# Altium schematic sheet main.SchDoc
size A; SheetNumber: 2; SheetTotal: 2
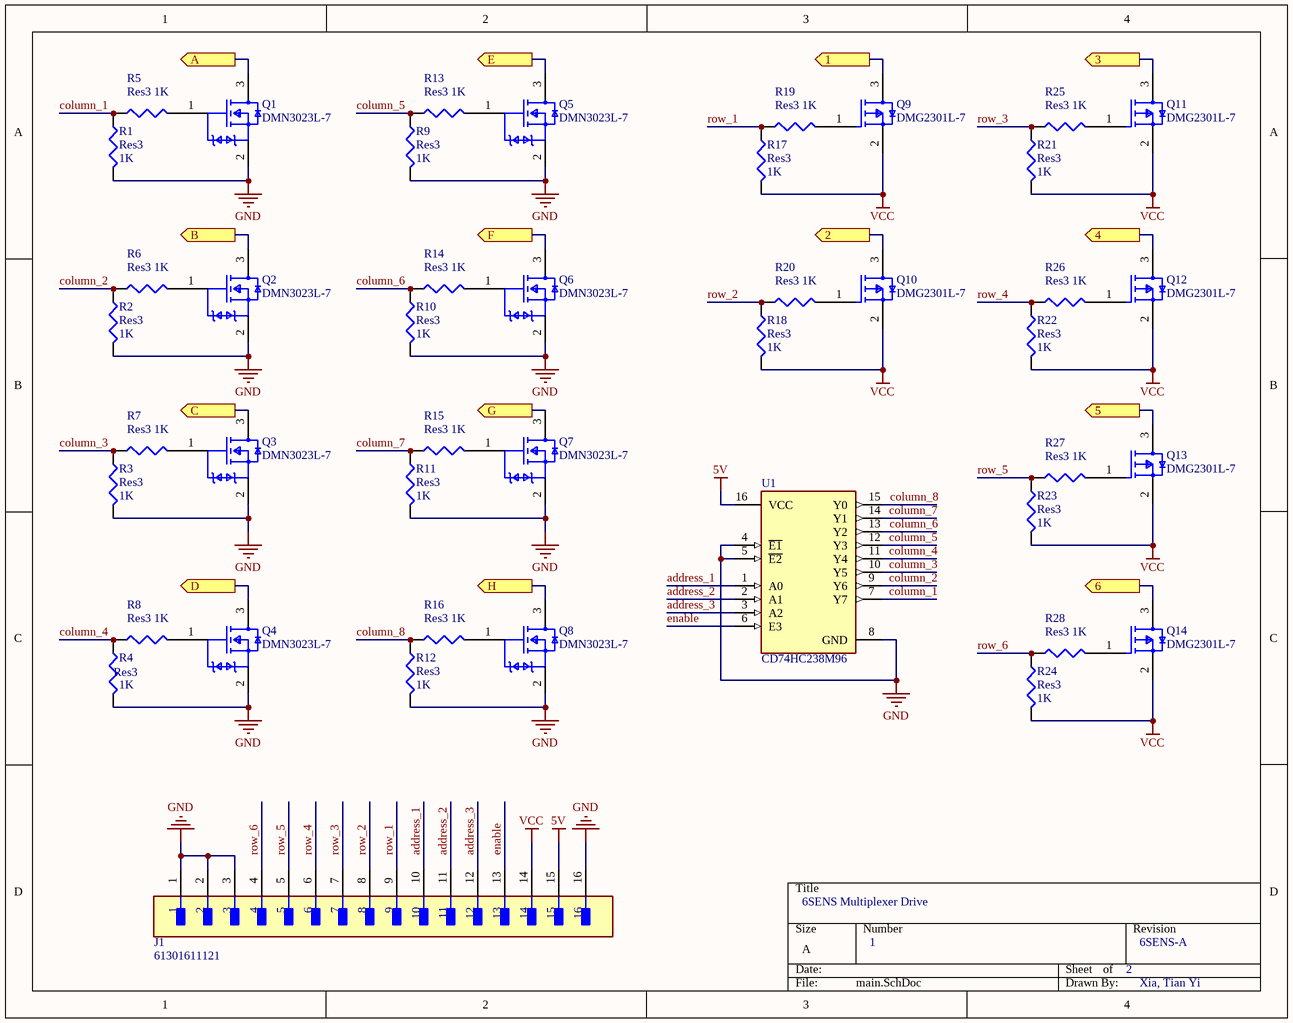
[diagram p0: main.SchDoc]

## Parts
J1  61301611121  [FP-61301611121-MFG]
Q1  DMN3023L-7  [FP-SOT23-MFG]
Q2  DMN3023L-7  [FP-SOT23-MFG]
Q3  DMN3023L-7  [FP-SOT23-MFG]
Q4  DMN3023L-7  [FP-SOT23-MFG]
Q5  DMN3023L-7  [FP-SOT23-MFG]
Q6  DMN3023L-7  [FP-SOT23-MFG]
Q7  DMN3023L-7  [FP-SOT23-MFG]
Q8  DMN3023L-7  [FP-SOT23-MFG]
Q9  DMG2301L-7  [FP-SOT23-MFG]
Q10  DMG2301L-7  [FP-SOT23-MFG]
Q11  DMG2301L-7  [FP-SOT23-MFG]
Q12  DMG2301L-7  [FP-SOT23-MFG]
Q13  DMG2301L-7  [FP-SOT23-MFG]
Q14  DMG2301L-7  [FP-SOT23-MFG]
R1  Res3  value 1K  [J1-0603]
R2  Res3  value 1K  [J1-0603]
R3  Res3  value 1K  [J1-0603]
R4  Res3  value 1K  [J1-0603]
R5  Res3  value 1K  [J1-0603]
R6  Res3  value 1K  [J1-0603]
R7  Res3  value 1K  [J1-0603]
R8  Res3  value 1K  [J1-0603]
R9  Res3  value 1K  [J1-0603]
R10  Res3  value 1K  [J1-0603]
R11  Res3  value 1K  [J1-0603]
R12  Res3  value 1K  [J1-0603]
R13  Res3  value 1K  [J1-0603]
R14  Res3  value 1K  [J1-0603]
R15  Res3  value 1K  [J1-0603]
R16  Res3  value 1K  [J1-0603]
R17  Res3  value 1K  [J1-0603]
R18  Res3  value 1K  [J1-0603]
R19  Res3  value 1K  [J1-0603]
R20  Res3  value 1K  [J1-0603]
R21  Res3  value 1K  [J1-0603]
R22  Res3  value 1K  [J1-0603]
R23  Res3  value 1K  [J1-0603]
R24  Res3  value 1K  [J1-0603]
R25  Res3  value 1K  [J1-0603]
R26  Res3  value 1K  [J1-0603]
R27  Res3  value 1K  [J1-0603]
R28  Res3  value 1K  [J1-0603]
U1  CD74HC238M96  [FP-D0016A-MFG]

## Ports
1 (out), 2 (out), 3 (out), 4 (out), 5 (out), 6 (out), A (out), B (out), C (out), D (out), E (out), F (out), G (out), H (out)

## Nets
5V: J1.15 U1.16(VCC)
GND: J1.1 J1.2 J1.3 J1.16 Q1.2(S) Q2.2(S) Q3.2(S) Q4.2(S) Q5.2(S) Q6.2(S) Q7.2(S) Q8.2(S) R1.2 R2.2 R3.2 R4.2 R9.2 R10.2 R11.2 R12.2 U1.4(~{E1}) U1.5(~{E2}) U1.8(GND)
VCC: J1.14 Q9.2(S) Q10.2(S) Q11.2(S) Q12.2(S) Q13.2(S) Q14.2(S) R17.2 R18.2 R21.2 R22.2 R23.2 R24.2
1: Q9.3(D) ; port 1
2: Q10.3(D) ; port 2
3: Q11.3(D) ; port 3
4: Q12.3(D) ; port 4
5: Q13.3(D) ; port 5
6: Q14.3(D) ; port 6
A: Q1.3(D) ; port A
address_1: J1.10 U1.1(A0)
address_2: J1.11 U1.2(A1)
address_3: J1.12 U1.3(A2)
B: Q2.3(D) ; port B
C: Q3.3(D) ; port C
column_1: R1.1 R5.1 U1.7(Y7)
column_2: R2.1 R6.1 U1.9(Y6)
column_3: R3.1 R7.1 U1.10(Y5)
column_4: R4.1 R8.1 U1.11(Y4)
column_5: R9.1 R13.1 U1.12(Y3)
column_6: R10.1 R14.1 U1.13(Y2)
column_7: R11.1 R15.1 U1.14(Y1)
column_8: R12.1 R16.1 U1.15(Y0)
D: Q4.3(D) ; port D
E: Q5.3(D) ; port E
enable: J1.13 U1.6(E3)
F: Q6.3(D) ; port F
G: Q7.3(D) ; port G
H: Q8.3(D) ; port H
row_1: J1.9 R17.1 R19.1
row_2: J1.8 R18.1 R20.1
row_3: J1.7 R21.1 R25.1
row_4: J1.6 R22.1 R26.1
row_5: J1.5 R23.1 R27.1
row_6: J1.4 R24.1 R28.1
NetQ1_1: Q1.1(G) R5.2
NetQ2_1: Q2.1(G) R6.2
NetQ3_1: Q3.1(G) R7.2
NetQ4_1: Q4.1(G) R8.2
NetQ5_1: Q5.1(G) R13.2
NetQ6_1: Q6.1(G) R14.2
NetQ7_1: Q7.1(G) R15.2
NetQ8_1: Q8.1(G) R16.2
NetQ9_1: Q9.1(G) R19.2
NetQ10_1: Q10.1(G) R20.2
NetQ11_1: Q11.1(G) R25.2
NetQ12_1: Q12.1(G) R26.2
NetQ13_1: Q13.1(G) R27.2
NetQ14_1: Q14.1(G) R28.2

## Notes on the sheet
- 6SENS Multiplexer Drive
- 1
- 2
- 6SENS-A
- Xia, Tian Yi

## Library data of the parts
J1 = CMP-1502-01095-2: CONN HEADER VERT 16POS 2.54MM; Pitch: 0.1inch; Voltage Rating: 250V; Number of Contacts: 16; Gender: Male; Flammability Rating: UL94 V-0; Fastening Type: Pull; Contact Plating: Gold; Termination: Solder; Contact Type: Male Pin; Number of Rows: 1; Max Operating Temperature: 105°C; Insulation Color: Black; Min Operating Temperature: -40°C; Mount: Through Hole; Contact Mating Length: 0.236inch; Contact Finish - Mating: GOLD; Insulation Material: Nylon; Color: Black; Packaging: Bulk; Number of Positions: 16; RoHS Compliant: Yes; Series: WR-PHD; Connector Type: Header; Contact Material: Copper Alloy; Contact Shape: Square
Q1-Q8 = CMP-12801-000035-1: MOSFET N-CH 30V 6.2A SOT23; Manufacturer: Diodes Inc.; Automotive Grade: Grade 0; Max Junction Temp: +150°C; Number Of Channels: 1; Threshold Vgs Max: 1.8V; Depletion Mode: False; Input Capacitace At Vds: 873pF @ 15V; Turn Off Delay Time: 231ns; Pulse Drain Current: 44A; Standoff Height: 0.013mm; Gate To Source Voltage: 20V; Rthja Max: 97°C/W; Gate Charge At Vgs: 18.4nC @ 10V; Drain To Source Resistance: 25mΩ; Threshold Vgs Min: 0.8V; Turn On Delay Time: 17ns; Power Dissipation: 0.9W; Max Forward Diode Voltage: 1.2V; Category: Trans; Octopart: https://octopart.com/dmn3023l-7-diodes+inc.-65294126; Mouser Description: MOSFET N-Ch Enh Mode FET 30Vdss 20Vgss 51A; Digikey Description: MOSFET N-CH 30V 6.2A SOT23; Package: SOT23; Automotive: Yes; Number Of N Channels: 1; Height: 1.1mm; Device Class L3: MOSFETs; Device Class L1: Discrete Semiconductors; Footprint Url: https://www.diodes.com/assets/Package-Files/SOT23.pdf; Drain To Source Voltage: 30V; Device Class L2: Transistors; ComponentLink2Description: Datasheet; RoHS: TRUE; Continuous Drain Current: 6.2A; Lead Free: Yes; Temperature Range High: +150°C; Temperature: -55°C to +150°C; Manufacturer Part Number: DMN3023L-7; Drain To Source Breakdown Voltage: 30V; ComponentLink2URL: https://www.diodes.com/assets/Datasheets/DMN3023L.pdf; Temperature Range Low: -55°C
Q9-Q14 = CMP-12801-000065-1: MOSFET P-CH 20V 3A SOT23; Manufacturer: Diodes Inc.; Number Of Channels: 1; Turn On Delay Time: 5ns; Drain To Source Resistance: 120mΩ; Max Junction Temp: +150°C; Gate To Source Voltage: 8V; Power Dissipation: 1.5W; Rthja Max: 83°C/W; Max Forward Diode Voltage: -1.2V; Standoff Height: 0.013mm; Threshold Vgs Min: -0.4V; Input Capacitace At Vds: 476pF @ -10V; Depletion Mode: False; Gate Charge At Vgs: 5.5nC @ -4.5V; Pulse Drain Current: -10A; Drain To Source Voltage: -20V; Continuous Drain Current: -3A; Turn Off Delay Time: 30ns; Lead Free: Yes; Package: SOT23; ComponentLink2Description: Datasheet; Device Class L3: MOSFETs; Device Class L1: Discrete Semiconductors; Manufacturer Part Number: DMG2301L-7; Automotive: No; Height: 1.1mm; Category: Trans; Temperature Range High: +150°C; Digikey Description: MOSFET P-CH 20V 3A SOT23; RoHS: TRUE; Number Of P Channels: 1; Footprint Url: https://www.diodes.com/assets/Package-Files/SOT23.pdf; Octopart: https://octopart.com/dmg2301l-7-diodes+inc.-67250456; ComponentLink2URL: https://www.diodes.com/assets/Datasheets/DMG2301L.pdf; Mouser Description: Single P-Channel 20 V 1.5 W 5.5 nC Silicon Surface Mount Mosfet - SOT-23; Drain To Source Breakdown Voltage: -20V; Threshold Vgs Max: -1.2V; Device Class L2: Transistors; Temperature: -55°C to +150°C; Temperature Range Low: -55°C
R1-R28 = Res3: Resistor; Published: 8-Jun-2000; LatestRevisionDate: 29-May-2009; LatestRevisionNote: IPC-7351 Footprint Added.; PackageReference: J1-0603; Publisher: Altium Limited; PackageDescription: Chip Resistor
U1 = CMP-1633-00102-3: IC 3-8 DECODER/DEMUX HS 16-SOIC; Manufacturer: Texas Instruments; Number Of Inputs: 6; Max Junction Temp: +150°C; Max Supply Voltage: 6V; Number Of Circuits: 1; Min Supply Voltage: 2V; Standoff Height: 0.25mm; Number Of Outputs: 8; Propagation Delay: 13ns; Quiescent Current: 8uA; Ambient Temperature Range Low: -55°C; Device Class L2: Logic ICs; Temperature: -55°C to +125°C; RoHS: TRUE; Mouser Description: High Speed CMOS Logic 3-to-8 Line Decoder Demultiplexer Inverting and Non-Inverting 16-SOIC -55 to 125; Ipc Land Pattern Name: SOIC127P600X175-16; Octopart: https://octopart.com/cd74hc238m96-texas+instruments-1365099; ComponentLink2Description: Datasheet; Automotive: No; Temperature Range High: +125°C; Digikey Description: IC 3-8 DECODER/DEMUX HS 16-SOIC; Temperature Range Low: -55°C; Category: IC; Device Class L3: Decoders; Height: 1.75mm; Lead Free: Yes; Package: D0016A; Ambient Temperature Range High: +125°C; Device Class L1: Integrated Circuits (ICs); Manufacturer Part Number: CD74HC238M96; ComponentLink2URL: http://www.ti.com/lit/ds/symlink/cd74hc238.pdf